# Altium project BAT_INDICATOR.PrjPcb
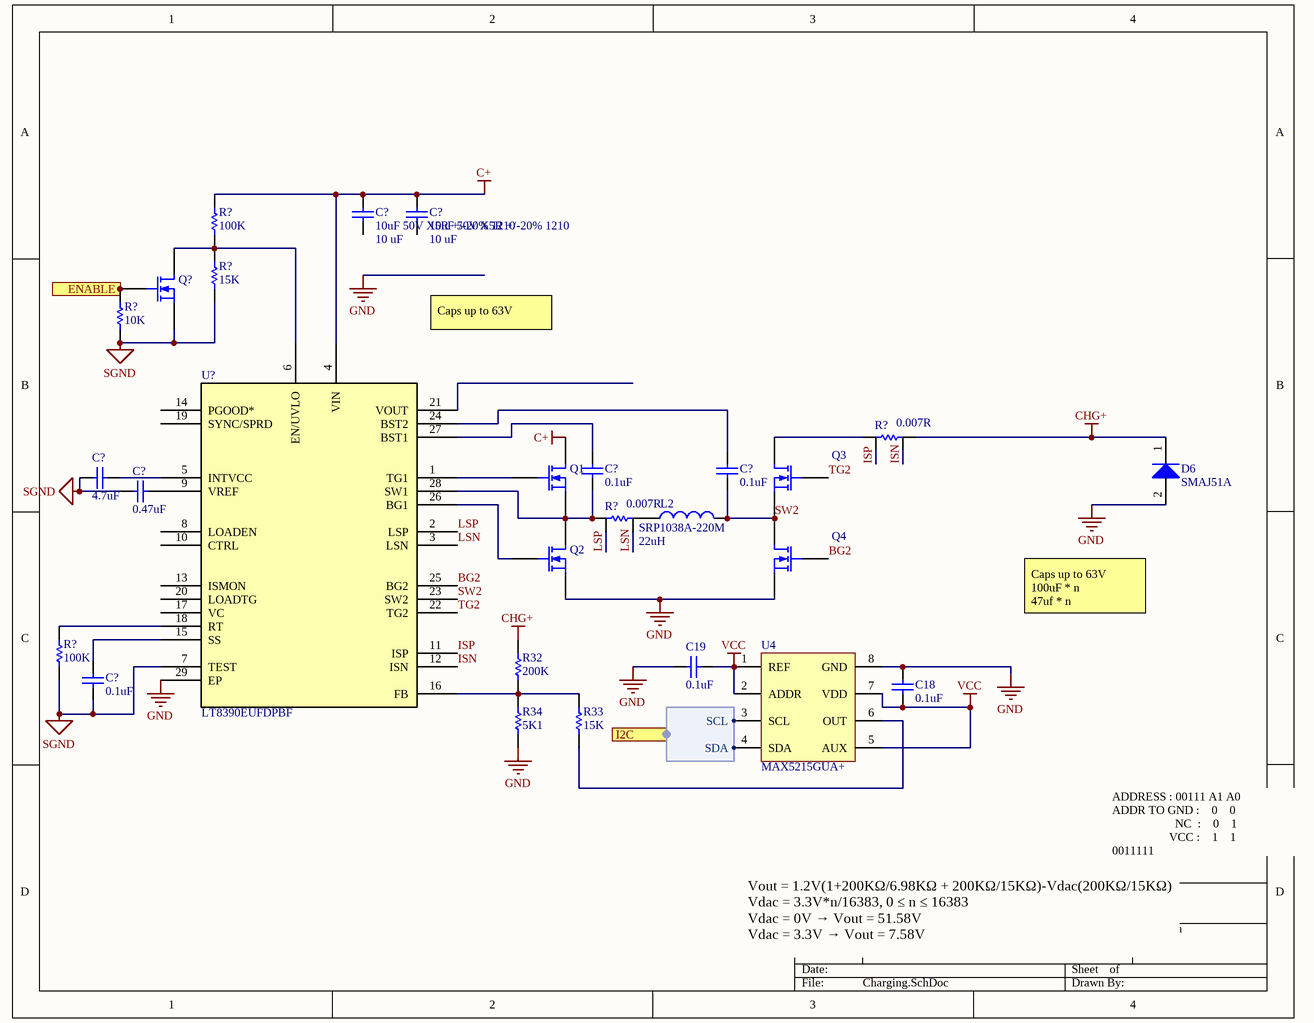
[diagram p0: Charging.SchDoc]
2 sheets, 45 parts. Net scope: flat (ports and power ports of the same name join across sheets).
Board file: Bat_Indicator.PcbDoc
Sheets:
  Charging.SchDoc
  BAT_INDICATOR.SchDoc

## Sheet Charging.SchDoc
size A; SheetNumber: 6

### Parts
(Parts that share a designator on the sheet are numbered #1, #2 ... from top to bottom, then left to right.)
C18  value 0.1uF  [C0603[1608X92]]  (hidden comment: 0.1uF 6.3V 0603)
C19  value 0.1uF  [C0603[1608X92]]  (hidden comment: 0.1uF 6.3V 0603)
C?#1  10uF 50V X5R +/-20% 1210  value 10 uF  [C1210[3225X150]]
C?#2  10uF 50V X5R +/-20% 1210  value 10 uF  [C1210[3225X150]]
C?#3  value 4.7uF  [C0603[1608X92]]  (hidden comment: 4.7uF 16V 0603)
C?#4  value 0.47uF  [C0603[1608X92]]  (hidden comment: 0.47uF 50V 0603)
C?#5  value 0.1uF  [C0603[1608X92]]  (hidden comment: 0.1uF 100V 0603)
C?#6  value 0.1uF  [C0603[1608X92]]  (hidden comment: 0.1uF 100V 0603)
C?#7  value 0.1uF  [C0603[1608X92]]  (hidden comment: 0.1uF 16V 0603)
D6  SMAJ51A  [DO-214AC]
L2  SRP1038A-220M  value 22uH  [SRP1038A]
Q1  SIS862DN-T1-GE3  [PowerPak-1212-8]  (value not drawn)
Q2  SIS862DN-T1-GE3  [PowerPak-1212-8]  (value not drawn)
Q3  SIS862DN-T1-GE3  [PowerPak-1212-8]  (value not drawn)
Q4  SIS862DN-T1-GE3  [PowerPak-1212-8]  (value not drawn)
Q?  BSS123WQ-7-F  [SOT323-3]  (value not drawn)
R32  value 200K  [R0603[1608]]  (hidden comment: 200K 1% 0603)
R33  value 15K  [R0603[1608]]  (hidden comment: 15K 1% 0603)
R34  value 5K1  [R0603[1608]]  (hidden comment: 5K1 1% 0603)
R?#1  value 100K  [R0603[1608]]  (hidden comment: 100K 1% 0603)
R?#2  value 15K  [R0603[1608]]  (hidden comment: 15K 1% 0603)
R?#3  value 10K  [R0603[1608]]  (hidden comment: 10K 1% 0603)
R?#4  value 0.007R  [KRL3216T4]  (hidden comment: KRL3216T4A-M-R007)
R?#5  value 0.007R  [KRL3216T4]  (hidden comment: KRL3216T4A-M-R007)
R?#6  value 100K  [R0603[1608]]  (hidden comment: 100K 1% 0603)
U4  MAX5215GUA+  [MSOP-8]
U?  LT8390EUFDPBF  [QFN-28 UFD]

### Ports
ENABLE (in), I2C (harness I2C)

### Harnesses
I2C: SCL, SDA

### Nets
C+: C?#1.2 C?#2.2 Q1.3(D) R?#1.2 U?.4(VIN)
CHG+: D6.1(K) R32.2 R?#4.2
GND: C18.1 C19.2 D6.2(A) Q2.1(S) Q4.1(S) R34.1 U4.8(GND) U?.29(EP)
SGND: C?#3.1 C?#4.1 C?#7.1 Q?.2(S) R?#2.1 R?#3.1 R?#6.1 U?.7(TEST)
VCC: C18.2 C19.1 U4.1(REF) U4.2(ADDR) U4.5(AUX) U4.7(VDD)
BG2: Q4.2(G) U?.25(BG2)
ISN: R?#4.4 U?.12(ISN)
ISP: R?#4.3 U?.11(ISP)
LSN: R?#5.4 U?.3(LSN)
LSP: R?#5.3 U?.2(LSP)
SW2: C?#6.1 L2.2 Q3.1(S) Q4.3(D) U?.23(SW2)
TG2: Q3.2(G) U?.22(TG2)
NetC?#3_2: C?#3.2 U?.5(INTVCC)
NetC?#4_2: C?#4.2 U?.9(VREF)
NetC?#5_1: C?#5.1 Q1.1(S) Q2.3(D) R?#5.1 U?.28(SW1)
NetC?#5_2: C?#5.2 U?.27(BST1)
NetC?#6_2: C?#6.2 U?.24(BST2)
NetC?#7_2: C?#7.2 U?.15(SS)
NetL2_1: L2.1 R?#5.2
NetQ1_2: Q1.2(G) U?.1(TG1)
NetQ2_2: Q2.2(G) U?.26(BG1)
NetQ3_3: Q3.3(D) R?#4.1
NetQ?_1: Q?.1(G) R?#3.2 ; port ENABLE
NetQ?_3: Q?.3(D) R?#1.1 R?#2.2 U?.6(EN/UVLO)
NetR32_1: R32.1 R33.2 R34.2 U?.16(FB)
NetR33_1: R33.1 U4.6(OUT)
NetR?#6_2: R?#6.2 U?.18(RT)
NetU4_3: U4.3(SCL) ; port I2C.SCL
NetU4_4: U4.4(SDA) ; port I2C.SDA

Not connected (* = marked no-connect by the designer): C?#1 1; C?#2 1; U? 8(LOADEN) 10(CTRL) 13(ISMON) 14(PGOOD*) 17(VC) 19(SYNC/SPRD) 20(LOADTG) 21(VOUT)

### Notes on the sheet
- Caps up to 63V
- Caps up to 63V
  100uF * n
  47uf * n
- ADDRESS : 00111 A1 A0
  ADDR TO GND :    0    0
  NC  :    0    1
  VCC :    1    1
  0011111
- Vout = 1.2V(1+200KΩ/6.98KΩ + 200KΩ/15KΩ)-Vdac(200KΩ/15KΩ)
  Vdac = 3.3V*n/16383, 0 ≤ n ≤ 16383
  Vdac = 0V → Vout = 51.58V
  Vdac = 3.3V → Vout = 7.58V

### Library data of the parts
C18 C19 = CAP_0.1uF_6.3V_0603_10%: 0.1uF 6.3V 10% 0603 (1608 Metric); PartNumber: GRM188R70J104KA01D; Manufacturer: Murata; Mounting Technology: Surface Mount; PackageReference: 0603; PackageDescription: 0603 (1608 Metric); Voltage: 6.3V; Tolerance: 10%
C?#1 C?#2 = CAP_10uF_50V_1210_20%: Manufacturer: Taiyo Yuden; PartNumber: UMK325BJ106MM-T; Tolerance: 20%; Voltage: 50V; Mounting Technology: Surface Mount; PackageReference: 1210; PackageDescription: 1210 (3325 Metric)
C?#3 = CAP_4.7uF_16V_0603_10%: 4.7uF 16V 10% 0603 (1608 Metric); PartNumber: GRM188R61A475KE15D; Manufacturer: Murata; TemperatureCoefficient: X5R; Mounting Technology: Surface Mount; PackageReference: 0603; PackageDescription: 0603 (1608 Metric); Voltage: 16V; Tolerance: 10%
C?#4 = CAP_0.47uF_50V_0603_10%: 0.47uF 50V 10% 0603 (1608 Metric); PartNumber: GRM188R61H474KA12D; Manufacturer: Murata; TemperatureCoefficient: X5R; Mounting Technology: Surface Mount; PackageReference: 0603; PackageDescription: 0603 (1608 Metric); Voltage: 50V; Tolerance: 10%
C?#5 C?#6 = CAP_0.1uF_100V_0603_10%: 0.1uF 100V 10% 0603 (1608 Metric); PartNumber: GRM188R72A104KA35D; Manufacturer: Murata; TemperatureCoefficient: X7R; Mounting Technology: Surface Mount; PackageReference: 0603; PackageDescription: 0603 (1608 Metric); Voltage: 100V; Tolerance: 10%
C?#7 = CAP_0.1uF_16V_0603_10%: 0.1uF 16V 10% 0603 (1608 Metric); PartNumber: GCM188R71C104KA37D; Manufacturer: Murata; TemperatureCoefficient: X7R; Mounting Technology: Surface Mount; PackageReference: 0603; PackageDescription: 0603 (1608 Metric); Voltage: 16V; Tolerance: 10%
D6 = SMAJ51A-E3/61: Manufacturer: Vishay; PartNumber: SMAJ51A-E3/61; PackageReference: DO-214AC; PackageDescription: DO-214AC, 2 Leads; Mounting Technology: Surface Mount
L2 = SRP1038A-220M: 22uH 20% 7A 1038; Manufacturer: Bourns; PackageReference: SRP1038A; PartNumber: SRP1038A-220M; Mounting Technology: Surface Mount; Current: 7A
Q1-Q4 = SIS862DN-T1-GE3: N-Channel MOSFET; Manufacturer: Vishay; PackageReference: PowerPAK-1212-8; PartNumber: SIS862DN-T1-GE3; Mounting Technology: Surface Mount
Q? = BSS123WQ-7-F: N-Channel MOSFET; Manufacturer: Diodes Incorporated; PackageReference: SOT-323-3; PartNumber: BSS123WQ-7-F; Mounting Technology: Surface Mount
R32 = RES_200K_0603_1%: 200K 0.25W 1% 0603 (1005 Metric); Manufacturer: Rohm Semiconductor; PartNumber: ESR03EZPJ204; Tolerance: 5%; Power: 0.25W; Mounting Technology: Surface Mount; PackageReference: 0603; PackageDescription: 0603 (1608 Metric); ComponentLink1Description: Datasheet; ComponentLink1URL: http://www.vishay.com/docs/20043/crcwhpe3.pdf
R33 R?#2 = RES_15K_0603_1%: 15K 0.25W 1% 0603 (1005 Metric); Manufacturer: Vishay / Dale; PartNumber: CRCW060315K0FKEAHP; Tolerance: 1%; Power: 0.25W; Mounting Technology: Surface Mount; PackageReference: 0603; PackageDescription: 0603 (1608 Metric); ComponentLink1Description: Datasheet; ComponentLink1URL: http://www.vishay.com/docs/20043/crcwhpe3.pdf
R34 = RES_5K1_0603_1%: 5K1 0.25W 1% 0603 (1005 Metric); Manufacturer: Vishay / Dale; PartNumber: CRCW06035K10FKEA; Tolerance: 1%; Power: 0.25W; Mounting Technology: Surface Mount; PackageReference: 0603; PackageDescription: 0603 (1608 Metric); ComponentLink1Description: Datasheet; ComponentLink1URL: http://www.vishay.com/docs/20035/dcrcwe3.pdf
R?#1 R?#6 = RES_100K_0603_1%: 100K 0.25W 1% 0603 (1005 Metric); Manufacturer: Vishay / Dale; PartNumber: CRCW0603100KFKEAHP; Tolerance: 1%; Power: 0.25W; Mounting Technology: Surface Mount; PackageReference: 0603; PackageDescription: 0603 (1608 Metric); ComponentLink1Description: Datasheet; ComponentLink1URL: http://www.vishay.com/docs/20043/crcwhpe3.pdf
R?#3 = RES_10K_0603_1%: 10K 0.25W 1% 0603 (1005 Metric); Manufacturer: Vishay / Dale; PartNumber: CRCW060310K0FKEAHP; Power: 0.25W; Tolerance: 1%; Mounting Technology: Surface Mount; PackageReference: 0603; PackageDescription: 0603 (1608 Metric); ComponentLink1Description: Datasheet; ComponentLink1URL: http://www.vishay.com/docs/20065/rcse3.pdf
R?#4 R?#5 = KRL3216T4A-M-R007: Current Sense Resistor, 0.007R; Manufacturer: Susumu; Power: 1W; Tolerance: 1%; PartNumber: KRL3216T4A-M-R007; PackageReference: 1206; Mounting Technology: Surface Mount
U4 = MAX5215GUA+: 14 Bit Digital to Analog Converter; Manufacturer: Maxim Integrated; PartNumber: MAX5215GUA+; Mounting Technology: Surface Mount; PackageReference: MSOP-8
U? = LT8390EUFDPBF: 60V Synchronous 4-Switch Buck-Boost Controller; PartNumber: Linear Technology; Manufacturer: Texas Instruments; Mounting Technology: Surface Mount; PackageReference: QFN-28 UFD

## Sheet BAT_INDICATOR.SchDoc
size A4
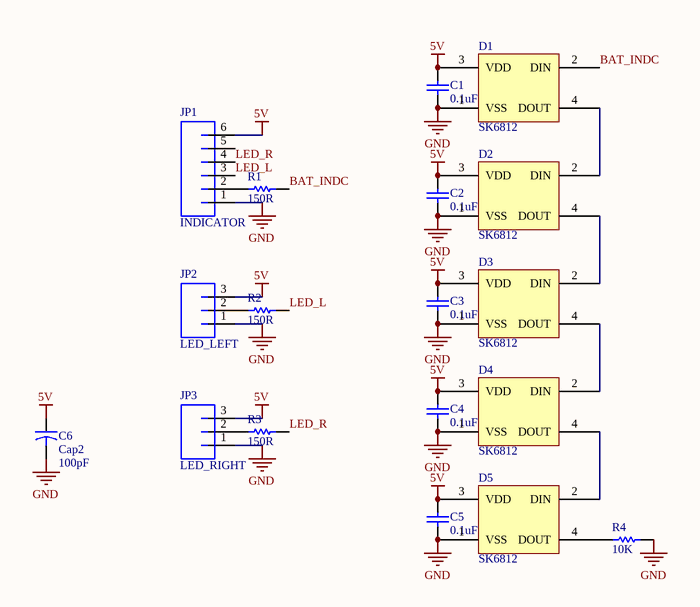
[diagram p1: BAT_INDICATOR.SchDoc]

### Parts
C1  value 0.1uF  [C0603[1608X92]]  (hidden comment: 0.1uF 16V 0603)
C2  value 0.1uF  [C0603[1608X92]]  (hidden comment: 0.1uF 16V 0603)
C3  value 0.1uF  [C0603[1608X92]]  (hidden comment: 0.1uF 16V 0603)
C4  value 0.1uF  [C0603[1608X92]]  (hidden comment: 0.1uF 16V 0603)
C5  value 0.1uF  [C0603[1608X92]]  (hidden comment: 0.1uF 16V 0603)
C6  Cap2  value 100pF  [CAPR5-4X5]
D1  SK6812  [SK6812]
D2  SK6812  [SK6812]
D3  SK6812  [SK6812]
D4  SK6812  [SK6812]
D5  SK6812  [SK6812]
JP1  INDICATOR  [JST-PH-6-PTH-VERT]
JP2  LED_LEFT  [JST-PH-3-PTH-VERT]
JP3  LED_RIGHT  [JST-PH-3-PTH-VERT]
R1  value 150R  [R0603[1608]]  (hidden comment: 150R 1% 0603)
R2  value 150R  [R0603[1608]]  (hidden comment: 150R 1% 0603)
R3  value 150R  [R0603[1608]]  (hidden comment: 150R 1% 0603)
R4  value 10K  [R0603[1608]]  (hidden comment: 10K 1% 0603)

### Nets
5V: C1.2 C2.2 C3.2 C4.2 C5.2 C6.1 D1.3(VDD) D2.3(VDD) D3.3(VDD) D4.3(VDD) D5.3(VDD) JP1.6 JP2.3 JP3.3
GND: C1.1 C2.1 C3.1 C4.1 C5.1 C6.2 D1.1(VSS) D2.1(VSS) D3.1(VSS) D4.1(VSS) D5.1(VSS) JP1.1 JP2.1 JP3.1 R4.1
BAT_INDC: D1.2(DIN) R1.2
LED_L: JP1.3 R2.2
LED_R: JP1.4 R3.2
NetD1_4: D1.4(DOUT) D2.2(DIN)
NetD2_4: D2.4(DOUT) D3.2(DIN)
NetD3_4: D3.4(DOUT) D4.2(DIN)
NetD4_4: D4.4(DOUT) D5.2(DIN)
NetD5_4: D5.4(DOUT) R4.2
NetJP1_2: JP1.2 R1.1
NetJP2_2: JP2.2 R2.1
NetJP3_2: JP3.2 R3.1

Not connected (* = marked no-connect by the designer): JP1 5

### Library data of the parts
C1-C5 = CAP_0.1uF_16V_0603_10%: as C?#7 on sheet Charging; Mounting Technology: Surface Mount; PackageReference: 0603; PackageDescription: 0603 (1608 Metric); Voltage: 16V; Tolerance: 10%
C6 = Cap2: Capacitor; Published: 23-Sep-2002; PackageReference: CAPR5-4X5; Publisher: Altium Limited; PackageDescription: Capacitor; 2 Leads
D1-D5 = SK6812: smart control circuit and a light emitting circuit in one of the controlled LED source
JP1 = JST_PH_6_VERT: PartNumber: B6B-PH-K-S(LF)(SN); Manufacturer: JST Sales America Inc.; PackageReference: JST-PH; Mounting Technology: Through Hole
JP2 JP3 = JST_PH_3_VERT: Manufacturer: JST Sales America Inc.; PartNumber: B3B-PH-K-S(LF)(SN); Mounting Technology: Through Hole; PackageReference: JST-PH
R1-R3 = RES_150R_0603_1%: 150R 0.25W 1% 0603 (1005 Metric); Manufacturer: Vishay / Dale; PartNumber: CRCW0603150RFKEAHP; Tolerance: 1%; Power: 0.25W; Mounting Technology: Surface Mount; PackageReference: 0603; PackageDescription: 0603 (1608 Metric); ComponentLink1Description: Datasheet; ComponentLink1URL: http://www.vishay.com/docs/20043/crcwhpe3.pdf
R4 = RES_10K_0603_1%: as R?#3 on sheet Charging; Tolerance: 1%; Power: 0.25W; Mounting Technology: Surface Mount; PackageReference: 0603; PackageDescription: 0603 (1608 Metric); ComponentLink1Description: Datasheet; ComponentLink1URL: http://www.vishay.com/docs/20065/rcse3.pdf

## Nets that join several sheets
GND: Charging (8 pins), BAT_INDICATOR (15 pins)